# Altium schematic sheet CHARGING_CIRCUIT_EXTERNAL.SchDoc
size 193 x 158 mm; Origin: Eagle
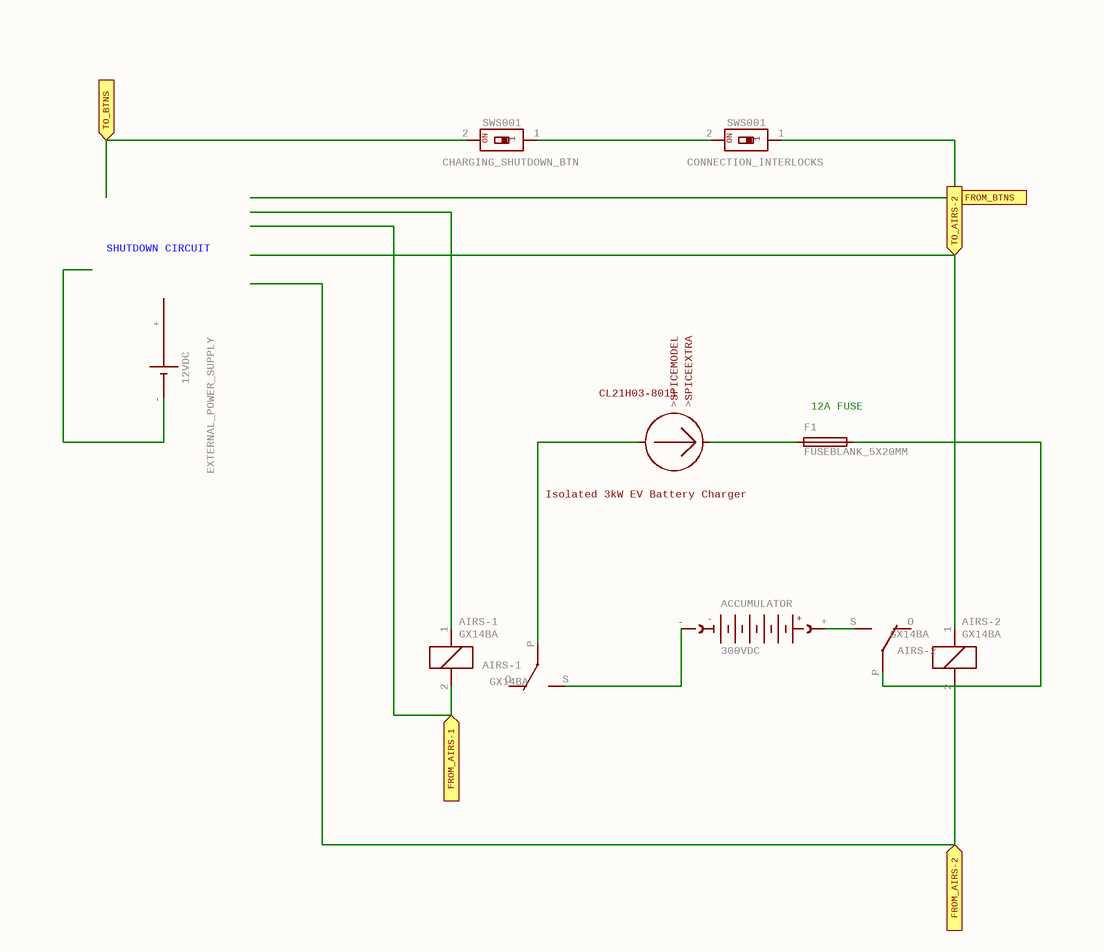
[diagram p0: CHARGING_CIRCUIT_EXTERNAL.SchDoc]

## Parts
ACCUMULATOR  300VDC  [AB9V]
AIRS-1  GX14BA  PART: AIRS-1  [V23127A]  (parts A,B of 2)
AIRS-2  GX14BA  PART: AIRS-2  [V23127A]  (parts A,B of 2)
CHARGING_SHUTDOWN_BTN  SWS001  [SMS-001]
CL21H03-8011  Isolated 3kW EV Battery Charger  SPICEMODEL: >SPICEMODEL  SPICEEXTRA: >SPICEEXTRA
CONNECTION_INTERLOCKS  SWS001  [SMS-001]
EXTERNAL_POWER_SUPPLY  12VDC  [B2430UNI]
F1  FUSEBLANK_5X20MM  [FUSE_HOLDER_5X20MM]

## Ports
FROM_AIRS-1 (in), FROM_AIRS-2 (in), FROM_BTNS (in), TO_AIRS-2 (in), TO_BTNS (in)

## Nets
FROM_AIRS-1: AIRS-1.2 ; port FROM_AIRS-1
FROM_AIRS-2: AIRS-2.2 AIRS-2.P F1.2 ; port FROM_AIRS-2
FROM_BTNS: AIRS-2.1 CONNECTION_INTERLOCKS.1 ; port FROM_BTNS, port TO_AIRS-2
TO_BTNS: CHARGING_SHUTDOWN_BTN.2 ; port TO_BTNS
NetACCUMULATOR_+: ACCUMULATOR.+ AIRS-2.S
NetACCUMULATOR_-: ACCUMULATOR.- AIRS-1.S
NetAIRS-1_P: AIRS-1.P CL21H03-8011.?1(+)
NetCHARGING_SHUTDOWN_BTN_1: CHARGING_SHUTDOWN_BTN.1 CONNECTION_INTERLOCKS.2
NetCL21H03-8011_?2: CL21H03-8011.?2(-) F1.1

Not connected (* = marked no-connect by the designer): AIRS-1 1 O; AIRS-2 O; EXTERNAL_POWER_SUPPLY + +@1(+) +@2(+) +@3(+) +@4(+) - -@1(-)

## Notes on the sheet
- SHUTDOWN CIRCUIT
- (near F1) 12A FUSE

## Library data of the parts
ACCUMULATOR = AB9V: 9-V BATTERY CLIP; GateName_1: G$1; SymbolName_1: 9V0-BL; LibraryName: battery; DeviceSetName: AB9V; +: +; -: -
AIRS-1 AIRS-2 = V23127A: RELAY   horizontal, 1 x switch, 5 A/300 V DC, 250 V AC, Siemens; GateName_1: 1; SymbolName_1: K; GateName_2: 2; SymbolName_2: U; LibraryName: relay; DeviceSetName: V23127A; MF: MF; MPN: MPN; OC_FARNELL: unknown; OC_NEWARK: unknown
CHARGING_SHUTDOWN_BTN CONNECTION_INTERLOCKS = SWS001: SMD Dip Switch 1 pol.; GateName_1: G$1; SymbolName_1: DIP01; LibraryName: smd-special; DeviceSetName: SWS001; ON: ON; 1: 1
CL21H03-8011 = CURRENT: Independent Current Source; GateName_1: G$1; SymbolName_1: CURRENT; LibraryName: ngspice-simulation; DeviceSetName: CURRENT; _EXTERNAL_: _EXTERNAL_
EXTERNAL_POWER_SUPPLY = B2430UNI: LI BATTERY; GateName_1: G$1; SymbolName_1: 1V2-2+5; LibraryName: battery; DeviceSetName: B2430UNI
F1 = FUSEBLANK_5X20MM: Fuse; GateName_1: G$1; SymbolName_1: FUSE; DeviceName: BLANK_5X20MM; LibraryName: fuse; DeviceSetName: FUSE; MF: MF; MPN: MPN; OC_FARNELL: unknown; OC_NEWARK: unknown